# Altium schematic sheet KH-6X6X5H-STM.schdoc
size 127 x 101 mm
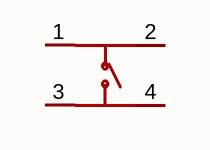
[diagram p0: KH-6X6X5H-STM.schdoc]

## Parts
SW?  kh-6x6x5h-stm  [SW-SMD_4P-L6.0-W6.0-P4.50-LS9.0_H5.0]  (value not drawn)

## Nets

Not connected (* = marked no-connect by the designer): SW? 1 2 3 4

## Library data of the parts
SW? = kh-6x6x5h-stm: 电路结构:单刀单掷;按钮形状:圆形按钮;安装方式:立贴;开关长度:6mm;开关宽度:6mm;开关高度:5mm;带支架:不带支架;触点电流:50mA;额定电压:12V;工作寿命:8万次;; Manufacturer: kinghelm(金航标); AddInBom: yes; ModelId: 46371efb35684031937580a0045530ec; ModelTransform: 354.33,236.25937,0,0,0,0,0,0,0; Circuit: 单刀单掷; Actuator Style: 圆形按钮; Switch Height: 5mm; with Bracket: 不带支架; Contact Current: 50mA; Voltage Rating: 12V; Actuator/Cap Color: 黑色; Life: 8万次; Symbol: KH-6X6X5H-STM; LCSC Part Name: 6*6*5mm 立贴 轻触开关; SupplierPart: C2837531; ManufacturerPart: KH-6X6X5H-STM; Supplier Footprint: SMD-4P,6x6mm; JLCPCB Part Class: Extended Part; Datasheet: https://item.szlcsc.com/datasheet/KH-6X6X5H-STM/3009601.html; Supplier: LCSC; ConvertToPcb: yes; FootprintName: SW-SMD_4P-L6.0-W6.0-P4.50-LS9.0_H5.0; ModelName: SW-SMD_4P-L6.0-W6.0-P4.50-LS9.0_H5.0; Mounting Type: 立贴; Length: 6mm; Width: 6mm; Termination Style: 鸥翼型